# EAGLE design trainer (EAGLE 7.3.0)
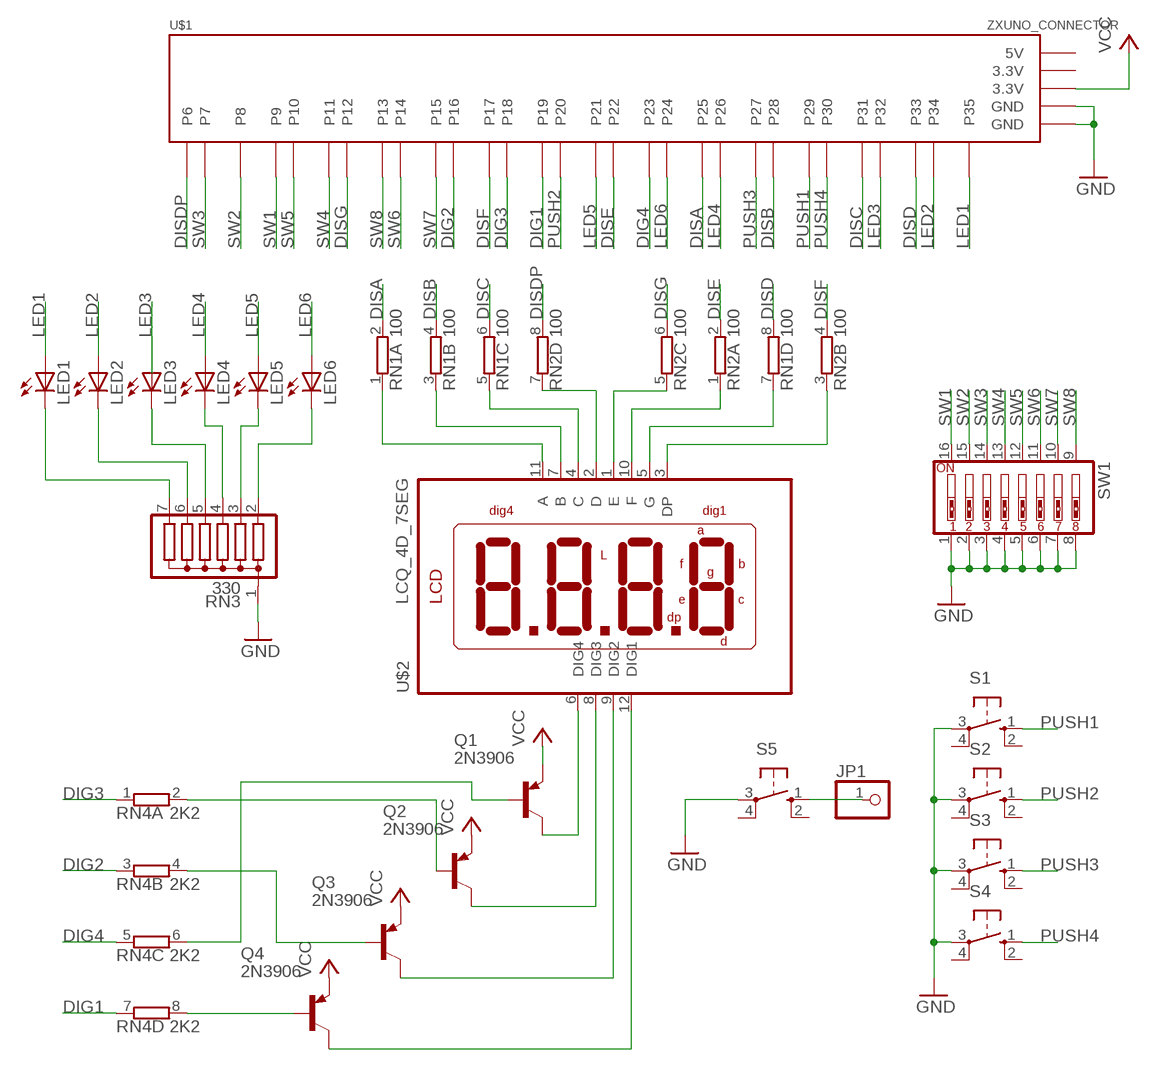
[diagram p0: schematic, sheet 1]

## Parts
JP1  PINHD-1X1  [1X01]
LED1  LED3MM  [LED3MM]
LED2  LED3MM  [LED3MM]
LED3  LED3MM  [LED3MM]
LED4  LED3MM  [LED3MM]
LED5  LED3MM  [LED3MM]
LED6  LED3MM  [LED3MM]
Q1  2N3906  [TO92]
Q2  2N3906  [TO92]
Q3  2N3906  [TO92]
Q4  2N3906  [TO92]
RN1  100  E4R  [SIL8]
RN2  100  E4R  [SIL8]
RN3  330  G06R  [SIL7]
RN4  2K2  E4R  [SIL8]
S1  10-XX  [B3F-10XX]
S2  10-XX  [B3F-10XX]
S3  10-XX  [B3F-10XX]
S4  10-XX  [B3F-10XX]
S5  10-XX  [B3F-10XX]
SW1  SW_DIP-8  [EDG-08]
U$1  ZXUNO_CONNECTOR  [ZXUNO_CONNECTOR]
U$2  LCQ_4D_7SEG  [LDQ_4D_7SEG]

## Nets
DIG1: RN4.7 U$1.P19
DIG2: RN4.3 U$1.P16
DIG3: RN4.1 U$1.P18
DIG4: RN4.5 U$1.P23
DISA: RN1.2 U$1.P25
DISB: RN1.4 U$1.P28
DISC: RN1.6 U$1.P31
DISD: RN1.8 U$1.P33
DISDP: RN2.8 U$1.P6
DISE: RN2.2 U$1.P22
DISF: RN2.4 U$1.P17
DISG: RN2.6 U$1.P12
GND: RN3.1 S1.3(P) S2.3(P) S3.3(P) S4.3(P) S5.3(P) SW1.1 SW1.2 SW1.3 SW1.4 SW1.5 SW1.6 SW1.7 SW1.8 U$1.GND@1(GND) U$1.GND@2(GND)
LED1: LED1.A U$1.P35
LED2: LED2.A U$1.P34
LED3: LED3.A U$1.P32
LED4: LED4.A U$1.P26
LED5: LED5.A U$1.P21
LED6: LED6.A U$1.P24
N$1: Q1.1(C) U$2.6(DIG4)
N$2: Q2.1(C) U$2.8(DIG3)
N$3: Q3.1(C) U$2.9(DIG2)
N$4: Q4.1(C) U$2.12(DIG1)
N$5: Q2.2(B) RN4.2
N$6: Q1.2(B) RN4.6
N$7: Q3.2(B) RN4.4
N$8: Q4.2(B) RN4.8
N$9: RN1.1 U$2.11(A)
N$10: RN1.3 U$2.7(B)
N$11: RN1.5 U$2.4(C)
N$12: RN2.7 U$2.2(D)
N$13: RN2.5 U$2.1(E)
N$14: RN2.1 U$2.10(F)
N$15: JP1.1 S5.1(S)
N$18: RN2.3 U$2.3(DP)
N$20: RN1.7 U$2.5(G)
N$25: LED4.K(C) RN3.4
N$26: LED5.K(C) RN3.3
N$27: LED3.K(C) RN3.5
N$28: LED2.K(C) RN3.6
N$29: LED1.K(C) RN3.7
N$30: LED6.K(C) RN3.2
PUSH1: S1.1(S) U$1.P29
PUSH2: S2.1(S) U$1.P20
PUSH3: S3.1(S) U$1.P27
PUSH4: S4.1(S) U$1.P30
SW1: SW1.16 U$1.P9
SW2: SW1.15 U$1.P8
SW3: SW1.14 U$1.P7
SW4: SW1.13 U$1.P11
SW5: SW1.12 U$1.P10
SW6: SW1.11 U$1.P14
SW7: SW1.10 U$1.P15
SW8: SW1.9 U$1.P13
VCC: Q1.3(E) Q2.3(E) Q3.3(E) Q4.3(E) U$1.3.3V@2(3.3V)
Unconnected: S1.2(S1) S1.4(P1) S2.2(S1) S2.4(P1) S3.2(S1) S3.4(P1) S4.2(S1) S4.4(P1) S5.2(S1) S5.4(P1)

## Power pins joined to a net without a drawn wire
3.3V: U$1.3.3V@1(3.3V)
5V: U$1.5V

## Library data of the parts
JP1 = pinhead:PINHD-1X1: PIN HEADER
LED1-LED6 = led:LED: LED OSRAM: - CHIPLED LG R971, LG N971, LY N971, LG Q971, LY Q971, LO R971, LY R971 LH N974, LH R974 LS Q976, LO Q976, LY Q976 LO Q996 - Hyper CHIPLED LW Q18S LB Q993, LB Q99A, LB R99A - SideLED LS A670, LO A670, LY A670, LG A670, LP A670 LB A673, LV A673, LT A673, LW A673 LH A674 LY A675 LS A676, LA A676, LO A676, LY A676, LW A676 LS A679, LY A679, LG A679 - Hyper Micro SIDELED® LS Y876, LA Y876, LO Y876, LY Y876 LT Y87S - SmartLED LW L88C, LW L88S LB L89C, LB L89S, LG L890 LS L89K, LO L89K, LY L89K LS L896, LA L896, LO L896, LY L896 - TOPLED LS T670, LO T670, LY T670, LG T670, LP T670 LSG T670, LSP T670, LSY T670, LOP T670, LYG T670 LG T671, LOG T671, LSG T671 LB T673, LV T673, LT T673, LW T673 LH T674 LS T676, LA T676, LO T676, LY T676, LB T676, LH T676, LSB T676, LW T676 LB T67C, LV T67C, LT T67C, LS T67K, LO T67K, LY T67K, LW E67C LS E67B, LA E67B, LO E67B, LY E67B, LB E67C, LV E67C, LT E67C LW T67C LS T679, LY T679, LG T679 LS T770, LO T770, LY T770, LG T770, LP T770 LB T773, LV T773, LT T773, LW T773 LH T774 LS E675, LA E675, LY E675, LS T675 LS T776, LA T776, LO T776, LY T776, LB T776 LHGB T686 LT T68C, LB T68C - Hyper Mini TOPLED® LB M676 - Mini TOPLED Santana® LG M470 LS M47K, LO M47K, LY M47K Source: http://www.osram.convergy.de LUXEON: - LUMILED® LXK2-PW12-R00, LXK2-PW12-S00, LXK2-PW14-U00, LXK2-PW14-V00 LXK2-PM12-R00, LXK2-PM12-S00, LXK2-PM14-U00 LXK2-PE12-Q00, LXK2-PE12-R00, LXK2-PE12-S00, LXK2-PE14-T00, LXK2-PE14-U00 LXK2-PB12-K00, LXK2-PB12-L00, LXK2-PB12-M00, LXK2-PB14-N00, LXK2-PB14-P00, LXK2-PB14-Q00 LXK2-PR12-L00, LXK2-PR12-M00, LXK2-PR14-Q00, LXK2-PR14-R00 LXK2-PD12-Q00, LXK2-PD12-R00, LXK2-PD12-S00 LXK2-PH12-R00, LXK2-PH12-S00 LXK2-PL12-P00, LXK2-PL12-Q00, LXK2-PL12-R00 Source: www.luxeon.com KINGBRIGHT: KA-3528ASYC Source: www.kingbright.com
Q1-Q4 = transistor-pnp:2N3906: PNP Transistor
RN1 RN2 RN4 = resistor-sil:E4R: SIL RESISTOR; OC_FARNELL: unknown; OC_NEWARK: unknown
RN3 = resistor-sil:G06R: SIL RESISTOR; OC_FARNELL: unknown; OC_NEWARK: unknown
S1-S5 = switch-omron:10-XX: OMRON SWITCH; MPN: B3F-1000; OC_FARNELL: 176432; OC_NEWARK: 36M3542
SW1 = special:SW_DIP-8: DIP SWITCH
U$1 = zxuno:ZXUNO_CONNECTOR
U$2 = mylib:LCQ_4D_7SEG

## Board
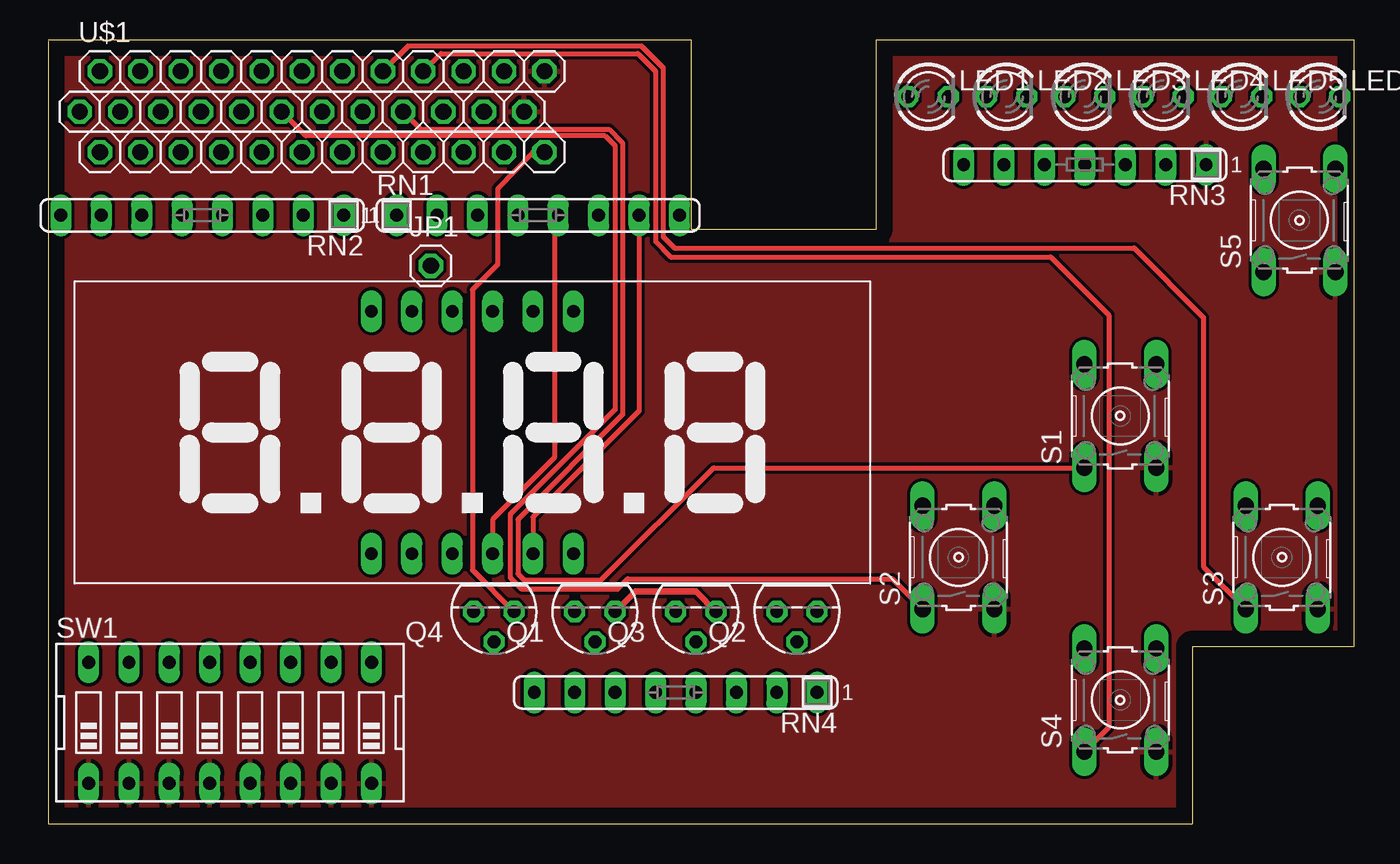
[diagram p1: board, top side]
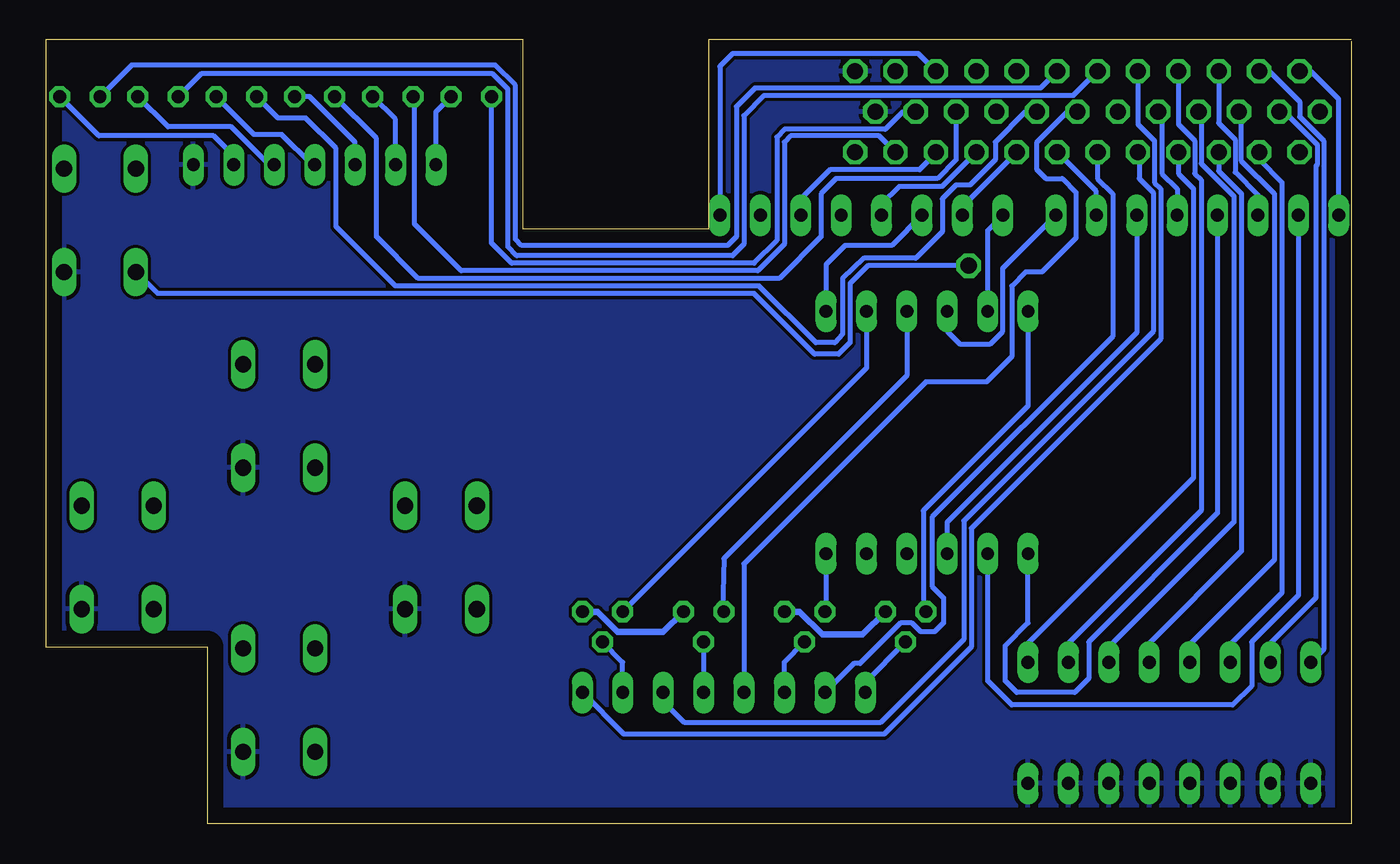
[diagram p2: board, bottom side, seen from below]

Size 82.07 x 49.29 mm. Coordinates in mm from the lower left corner, seen from the top.
Outline: 0,49.2 0,0 71.91,0 71.91,11.11 82.07,11.11 82.07,49.29 52.07,49.29 52.07,37.39 40.4,37.39 40.4,49.29 0,49.29
Copper layers (1*16): Top 0.035mm / dielectric 1.5mm / Bottom 0.035mm
Design rules "default": minimum track width 10mil, minimum drill 24mil, track to track 8mil, track to pad 8mil, pad to pad 8mil, via to via 8mil, smd to smd 8mil, copper to edge 40mil, drill to drill 8mil, minimum pad ring 10mil, minimum via ring 8mil, stop-mask expansion 4mil, vias tented up to drill 0mil, thermal gap 10mil

### Footprints (pad centres in the part's own frame; a part is rotated, then mirrored left to right if it is on the bottom)
1X01 = drill 1.016 octagon: 1 0,0
LED3MM = drill 0.813 octagon: A -1.27,0; K 1.27,0
TO92 = drill 0.813 octagon: 1 1.27,0; 2 0,1.905; 3 -1.27,0
SIL8 = drill 0.813 long: 1 -8.89,0; 2 -6.35,0; 3 -3.81,0; 4 -1.27,0; 5 1.27,0; 6 3.81,0; 7 6.35,0; 8 8.89,0
SIL7 = drill 0.813 long: 1 -7.62,0; 2 -5.08,0; 3 -2.54,0; 4 0,0; 5 2.54,0; 6 5.08,0; 7 7.62,0
B3F-10XX = drill 1.016 long: 1 -3.251,2.261; 2 3.251,2.261; 3 -3.251,-2.261; 4 3.251,-2.261
EDG-08 = drill 0.813 long: 1 -8.89,-3.81; 2 -6.35,-3.81; 3 -3.81,-3.81; 4 -1.27,-3.81; 5 1.27,-3.81; 6 3.81,-3.81; 7 6.35,-3.81; 8 8.89,-3.81; 9 8.89,3.81; 10 6.35,3.81; 11 3.81,3.81; 12 1.27,3.81; 13 -1.27,3.81; 14 -3.81,3.81; 15 -6.35,3.81; 16 -8.89,3.81
ZXUNO_CONNECTOR = drill 1.016 octagon: 3.3V@1 -13.97,0; 3.3V@2 15.24,-2.54; 5V -12.7,-2.54; GND@1 15.24,2.54; GND@2 13.97,0; NC@1 12.7,2.54; P6 -12.7,2.54; P7 -10.16,-2.54; P8 -11.43,0; P9 -10.16,2.54; P10 -7.62,-2.54; P11 -8.89,0; P12 -7.62,2.54; P13 -5.08,-2.54; P14 -6.35,0; P15 -5.08,2.54; P16 -2.54,-2.54; P17 -3.81,0; P18 -2.54,2.54; P19 0,-2.54; P20 -1.27,0; P21 0,2.54; P22 2.54,-2.54; P23 1.27,0; P24 2.54,2.54; P25 5.08,-2.54; P26 3.81,0; P27 5.08,2.54; P28 7.62,-2.54; P29 6.35,0; P30 7.62,2.54; P31 10.16,-2.54; P32 8.89,0; P33 10.16,2.54; P34 12.7,-2.54; P35 11.43,0
LDQ_4D_7SEG = drill 0.8 long: 1 -6.35,-7.62; 2 -3.81,-7.62; 3 -1.27,-7.62; 4 1.27,-7.62; 5 3.81,-7.62; 6 6.35,-7.62; 7 6.35,7.62; 8 3.81,7.62; 9 1.27,7.62; 10 -1.27,7.62; 11 -3.81,7.62; 12 -6.35,7.62

### Placement (x,y rotation side)
JP1  24.05,35.08 0 top
LED1  55.32,45.72 0 top
LED2  60.25,45.72 0 top
LED3  65.17,45.72 0 top
LED4  70.09,45.72 0 top
LED5  75.01,45.72 0 top
LED6  79.93,45.72 0 top
Q1  34.37,13.34 180 top
Q2  47.07,13.34 180 top
Q3  40.72,13.34 180 top
Q4  28.02,13.34 180 top
RN1  30.8,38.26 0 top
RN2  9.68,38.26 180 top
RN3  65.17,41.43 180 top
RN4  39.45,8.26 180 top
S1  67.39,25.64 90 top
S2  57.23,16.75 90 top
S3  77.55,16.75 90 top
S4  67.39,7.78 90 top
S5  78.66,37.94 90 top
SW1  11.43,6.35 0 top
U$1  15.95,44.77 0 top
U$2  26.67,24.61 0 top

### Tracks (layer width: path | path; a pad name or v marks a point on that pad's centre or on a via)
DIG1
  Bottom 0.305: U$1.P19 15.95,40.56 15,39.61 15,30.64 26.35,19.29 26.35,14.92 25.64,14.21 25.64,12.62 26.19,12.06 27.07,12.06 27.62,12.62 28.34,12.62 30.88,10.08 31.27,10.08 RN4.7
DIG2
  Bottom 0.305: U$1.P16 13.34,42.31 13.34,40.56 12.46,39.69 12.46,30.96 24.37,19.05 24.37,11.59 29.61,6.35 41.91,6.35 43.26,7.7 RN4.3
DIG3
  Bottom 0.305: U$1.P18 13.41,43.97 12.38,42.94 12.38,40.32 11.99,39.93 11.99,30.48 23.89,18.57 23.89,11.11 29.37,5.64 45.72,5.64 RN4.1
DIG4
  Bottom 0.305: RN4.5 38.18,16.35 26.75,27.78 22.94,27.78 21.35,29.37 21.35,33.81 20.48,34.69 19.45,34.69 17.3,36.83 17.3,39.69 18.18,40.56 19.21,40.56 19.76,41.12 19.76,42.86 17.86,44.77 U$1.P23
DISA
  Bottom 0.305: RN1.2 24.45,38.81 U$1.P25
DISB
  Bottom 0.305: RN1.4 29.53,38.97 28.42,40.08 25.72,40.08 U$1.P28
DISC
  Bottom 0.305: U$1.P31 26.11,42.15 27.15,41.12 32.78,41.12 34.61,39.29 RN1.6
DISD
  Bottom 0.305: U$1.P33 27.23,48.42 38.89,48.42 39.69,47.62 RN1.8
DISDP
  Bottom 0.305: RN2.8 0.79,45.56 2.54,47.31 U$1.P6
DISE
  Bottom 0.305: RN2.2 16.03,39.77 U$1.P22
DISF
  Bottom 0.305: U$1.P17 12.14,44.69 11.91,44.45 11.91,40.88 10.95,39.93 RN2.4
DISG
  Bottom 0.305: U$1.P12 8.33,44.05 7.3,43.02 7.3,40.96 5.87,39.53 RN2.6
GND
  pour Top: 0.32,48.97 40.08,48.97 40.08,36.91 52.47,36.91 52.47,48.9 81.84,48.9 81.84,11.43 71.68,11.43 71.68,0.32 0.32,0.32
  pour Bottom: 0.32,48.97 40.08,48.97 40.08,36.91 52.47,36.91 52.47,48.9 81.84,48.9 81.84,11.43 71.68,11.43 71.68,0.32 0.32,0.32
LED1
  Bottom 0.305: U$1.P35 28.18,44.77 29.29,43.66 35.64,43.66 36.12,43.18 36.12,36.67 37.54,35.24 52.78,35.24 54.05,36.51 LED1.A
LED2
  Bottom 0.305: U$1.P34 29.69,43.26 35.24,43.26 35.64,42.86 35.64,36.43 37.31,34.77 55.96,34.77 58.9,37.7 58.9,45.64 LED2.A
LED3
  Bottom 0.305: U$1.P32 24.84,41.75 26.04,40.56 32.38,40.56 33.34,39.61 33.34,36.91 35.96,34.29 58.66,34.29 61.28,36.91 61.28,43.1 LED3.A
LED4
  Bottom 0.305: U$1.P26 20.48,44.77 22.38,42.86 22.38,41.75 23.97,40.16 24.84,40.16 25.72,39.29 25.72,37.23 27.38,35.56 30.64,35.56 31.99,34.29 31.99,30.8 32.46,30.24 33.66,30.24 37.23,33.81 60.09,33.81 63.82,37.54 63.82,42.47 65.72,44.37 67.47,44.37 LED4.A
LED5
  Bottom 0.305: LED5.A 72.31,47.15 53.98,47.15 53.02,46.2 53.02,36.27 52.47,35.72 38.89,35.72 38.18,36.43 38.18,44.53 36.91,45.8 17.46,45.8 U$1.P21
LED6
  Bottom 0.305: LED6.A 76.68,47.7 53.82,47.7 52.55,46.43 52.55,36.75 52.15,36.35 39.21,36.35 38.66,36.91 38.66,45.09 37.47,46.28 19.53,46.28 U$1.P24
N$1
  Bottom 0.305: U$2.6 33.02,13.41 Q1.1
N$2
  Bottom 0.305: U$2.8 30.48,28.65 Q2.1
N$3
  Bottom 0.305: U$2.9 27.94,28.18 39.45,16.67 39.53,13.41 Q3.1
N$4
  Bottom 0.305: U$2.12 20.32,26.27 26.91,19.68 26.91,13.49 Q4.1
N$5
  Bottom 0.305: RN4.2 45.8,10.16 Q2.2
N$6
  Bottom 0.305: RN4.6 35.64,10.16 Q1.2
N$7
  Bottom 0.305: Q3.2 RN4.4
N$8
  Bottom 0.305: RN4.8 30.56,8.89 Q4.2
N$9
  Bottom 0.305: U$2.11 22.86,37.31 RN1.1
N$10
  Bottom 0.305: RN1.3 28.89,36.35 31.83,36.35 33.02,35.16 U$2.7
N$11
  Top 0.305: RN1.5 32.07,38.18 31.83,37.94 31.83,23.02 27.94,19.13 U$2.4
N$12
  Bottom 0.305: RN2.7 3.33,14.37 6.27,11.43 6.27,8.65 7.46,7.46 21.35,7.46 22.86,8.97 U$2.2
N$13
  Bottom 0.305: RN2.5 8.41,19.53 16.51,11.43 16.51,9.13 17.38,8.26 21.03,8.26 21.75,8.97 21.75,11.19 20.32,12.62 U$2.1
N$14
  Bottom 0.305: U$2.10 25.4,30.96 24.61,30.16 22.7,30.16 21.91,30.96 21.91,34.92 RN2.1
N$15
  Bottom 0.305: JP1.1 30.4,35.08 31.51,33.97 31.51,30.24 32.23,29.53 33.73,29.53 37.54,33.34 75.05,33.34 S5.1
N$18
  Bottom 0.305: RN2.3 13.49,30.88 24.41,19.96 25.32,19.05 25.4,18.97 U$2.3
N$20
  Top 0.305: RN1.7 37.15,25.96 30.48,19.29 U$2.5
N$25
  Bottom 0.305: RN3.4 65.33,41.43 67.23,43.34 68.98,43.34 LED4.K
N$26
  Bottom 0.305: RN3.3 68.02,41.43 70.41,43.81 74.37,43.81 LED5.K
N$27
  Bottom 0.305: RN3.5 62.63,42.86 65.48,45.72 LED3.K
N$28
  Bottom 0.305: RN3.6 60.09,44.29 LED2.K
N$29
  Bottom 0.305: RN3.7 57.55,44.77 LED1.K
N$30
  Bottom 0.305: RN3.2 70.25,41.99 71.52,43.26 78.74,43.26 LED6.K
PUSH1
  Top 0.305: U$1.P29 23.42,43.66 35.24,43.66 36.12,42.78 36.12,25.72 29.53,19.13 29.53,15.72 29.92,15.32 34.77,15.32 41.83,22.38 S1.1
PUSH2
  Top 0.305: S2.1 53.07,15.4 36.43,15.4 35.8,14.76 29.77,14.76 29.05,15.48 29.05,19.45 35.64,26.04 35.64,42.62 35,43.26 16.19,43.26 U$1.P20
PUSH3
  Top 0.305: S3.1 72.63,16.16 72.63,31.83 68.26,36.2 39.37,36.2 38.66,36.91 38.66,47.55 37.31,48.9 22.62,48.9 U$1.P27
PUSH4
  Top 0.305: S4.1 66.67,6.07 66.67,31.99 63.02,35.64 39.13,35.64 38.18,36.59 38.18,47.31 37.07,48.42 24.69,48.42 U$1.P30
SW1
  Bottom 0.305: U$1.P9 5.16,47.31 3.25,45.4 3.25,44.45 1.75,42.94 1.75,10.95 SW1.16
SW2
  Bottom 0.305: U$1.P8 4.21,44.77 2.14,42.7 2.14,41.43 2.22,41.35 2.22,14.21 5.08,11.35 | 5,11.35 5.08,11.35 | 5.08,11.35 SW1.15
SW3
  Bottom 0.305: U$1.P7 5.79,41.75 4.37,40.32 4.37,14.53 7.62,11.27 SW1.14
SW4
  Bottom 0.305: SW1.13 10.16,11.27 4.84,16.59 4.84,39.61 6.91,41.67 6.91,44.61 U$1.P11
SW5
  Bottom 0.305: 12.7,10.08 SW1.12 12.7,11.35 6.91,17.14 6.91,39.61 8.33,41.04 U$1.P10
SW6
  Bottom 0.305: 15.24,10.08 SW1.11 15.24,11.11 7.38,18.97 7.38,39.45 9.45,41.51 9.45,44.53 9.6,44.69 U$1.P14
SW7
  Bottom 0.305: U$1.P15 10.87,43.97 9.84,42.94 9.84,40.88 9.45,40.48 9.45,19.68 17.78,11.35 SW1.10
SW8
  Bottom 0.305: U$1.P13 10.87,40.88 9.92,39.93 9.92,21.75 20.32,11.35 SW1.9
VCC
  Top 0.305: U$1.3.3V@2 30.48,42.23 28.26,39.93 28.26,35.16 26.67,33.58 26.67,15.95 Q4.3
  Top 0.406: Q1.3 36.91,14.61 40.72,14.61 Q3.3
  Bottom 0.406: Q2.3 47.39,13.34 46.12,12.06 43.26,12.06 Q3.3 | Q1.3 34.69,13.34 33.26,11.91 30.72,11.91 Q4.3